# EAGLE design tinyled (EAGLE 8.7.1)
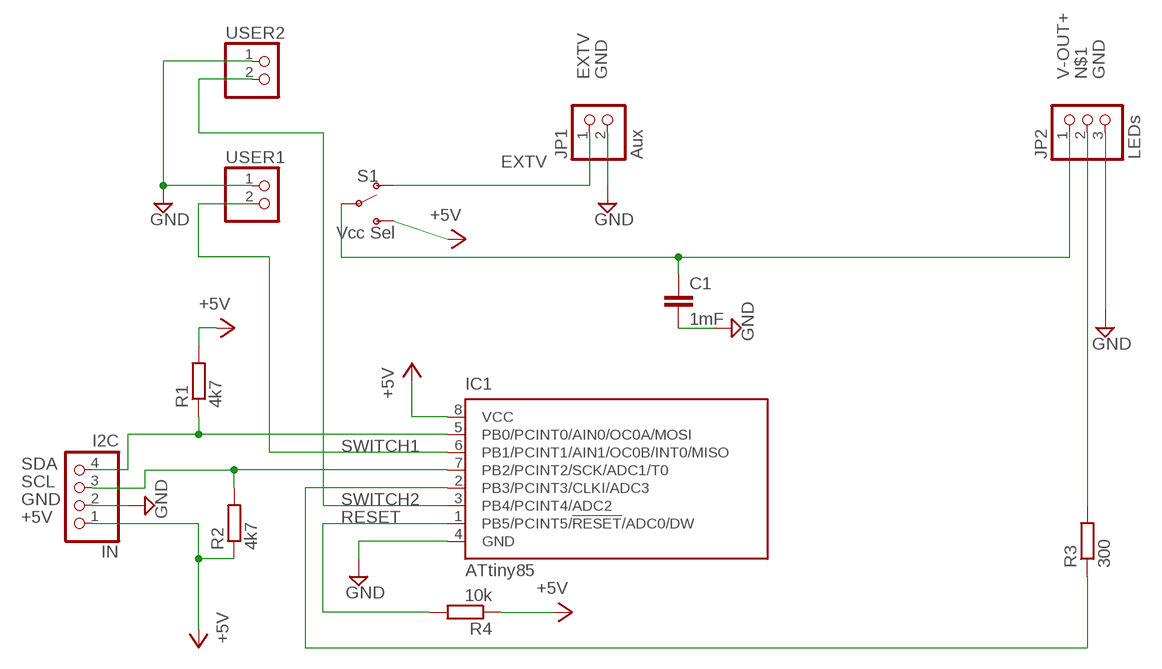
[diagram p0: schematic, sheet 1]

## Parts
C1  1mF  C-EU050-025X075  [C050-025X075]
IC1  ATtiny85  TINY13-20PU  [DIL08]
IN  I2C  PINHD-1X4/90  [1X04/90]
JP1  Aux  PINHD-1X2/90  [1X02/90]
JP2  LEDs  PINHD-1X3/90  [1X03/90]
R1  4k7  R0204/7  [0204/7]
R2  4k7  R0204/7  [0204/7]
R3  300  R0204/7  [0204/7]
R4  10k  R0204/7  [0204/7]
S1  Vcc Sel  SWITCH-SPDT-PTH-11.6X4.0MM  [SWITCH_SPDT_PTH_11.6X4.0MM]
USER1  PINHD-1X2  [1X02]
USER2  PINHD-1X2  [1X02]

## Nets
+5V: IC1.8(VCC) IN.1 R1.2 R2.1 R4.1 S1.3(S)
DATA: IC1.2(PB3/PCINT3/CLKI/ADC3) R3.1
EXTV [highload]: JP1.1 S1.1(O)
GND [highload]: C1.2 IC1.4(GND) IN.2 JP1.2 JP2.3 USER1.1 USER2.1
N$1: JP2.2 R3.2
RESET: IC1.1(PB5/PCINT5/!RESET!/ADC0/DW) R4.2
SCL: IC1.7(PB2/PCINT2/SCK/ADC1/T0) IN.3 R2.2
SDA: IC1.5(PB0/PCINT0/AIN0/OC0A/MOSI) IN.4 R1.1
SWITCH1: IC1.6(PB1/PCINT1/AIN1/OC0B/INT0/MISO) USER1.2
SWITCH2: IC1.3(PB4/PCINT4/ADC2) USER2.2
V-OUT+ [highload]: C1.1 JP2.1 S1.2(P)

## Library data of the parts
C1 = resistor:C-EU: CAPACITOR, European symbol
IC1 = atmel:TINY13: 8-bit AVR Microcontroller with 1K Bytes In-System Programmable Flash Source: http://www.atmel.com/dyn/resources/prod_documents/2535S.pdf; MPN: ATTINY13-20PU; OC_FARNELL: 9171550; OC_NEWARK: 96K6521
IN = pinhead:PINHD-1X4: PIN HEADER
JP1 USER1 USER2 = pinhead:PINHD-1X2: PIN HEADER
JP2 = pinhead:PINHD-1X3: PIN HEADER
R1-R4 = eagle-ltspice:R: RESISTOR, European symbol; SPICEMODEL: NONE; SPICEPREFIX: R
S1 = SparkFun-Switches:SWITCH-SPDT: Single Pole, Double Throw (SPDT) Switch Single-pole, double-throw (SPDT) switch. Variant Overview SMD-AYZ0202 Surface Mount DPDT Switch <https://www.sparkfun.com/products/597> (COM-00597) Used on e.g. LilyPad Arduino USB - ATmega32U4 Board <https://www.sparkfun.com/products/12049> PTH-11.6X4.0MM SPDT Mini Power Switch <https://www.sparkfun.com/products/102> (COM-00102) Used on e.g. SparkFun Simon Says - Through-Hole Soldering Kit <https://www.sparkfun.com/products/10547> (KIT-10547) PTH-11.6X4.0MM-KIT KIT version of SPDT Mini Power Switch - Simplifies soldering by removing tStop of switch pins - only one side can be soldered. PTH-11.6X4.0MM-LOCK LOCK version of SPDT Mini Power Switch - Offset pins hold switch in place for easier soldering. SMD-RIGHT-ANGLE Surface Mount Right Angle Switch <https://www.sparkfun.com/products/10860> (COM-10860) Used on e.g. SparkFun ESP8266 Thing <https://www.sparkfun.com/products/13231>; PROD_ID: SWCH-08261; SF_SKU: COM-00102

## Net classes
1 highload: width 0.813 mm

## Board
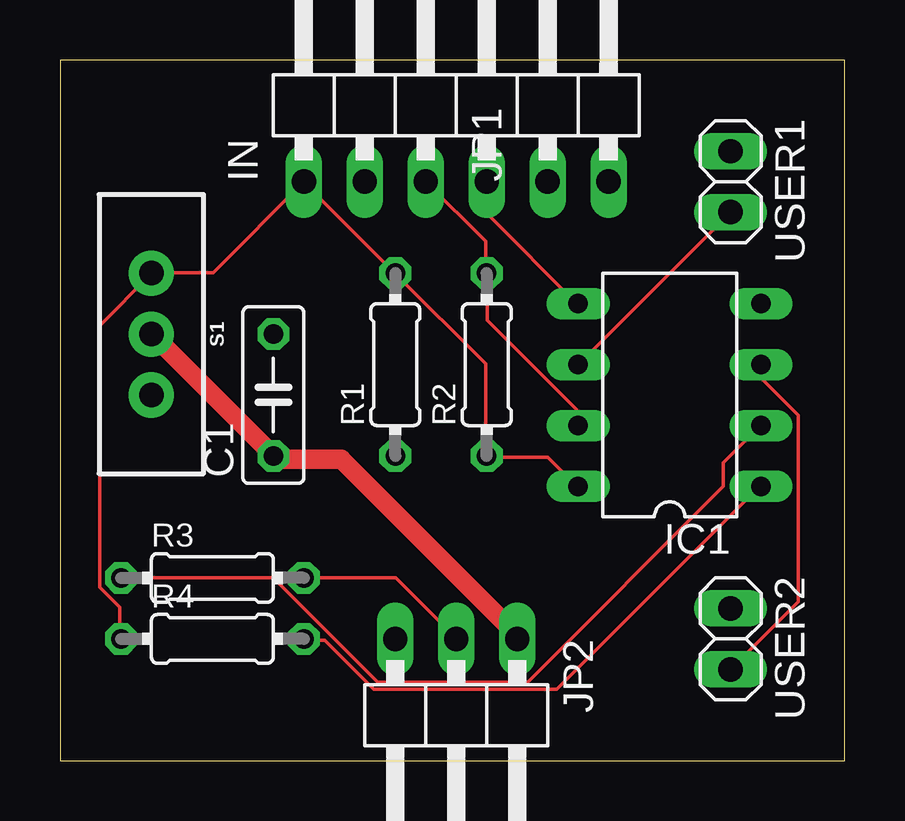
[diagram p1: board, top side]
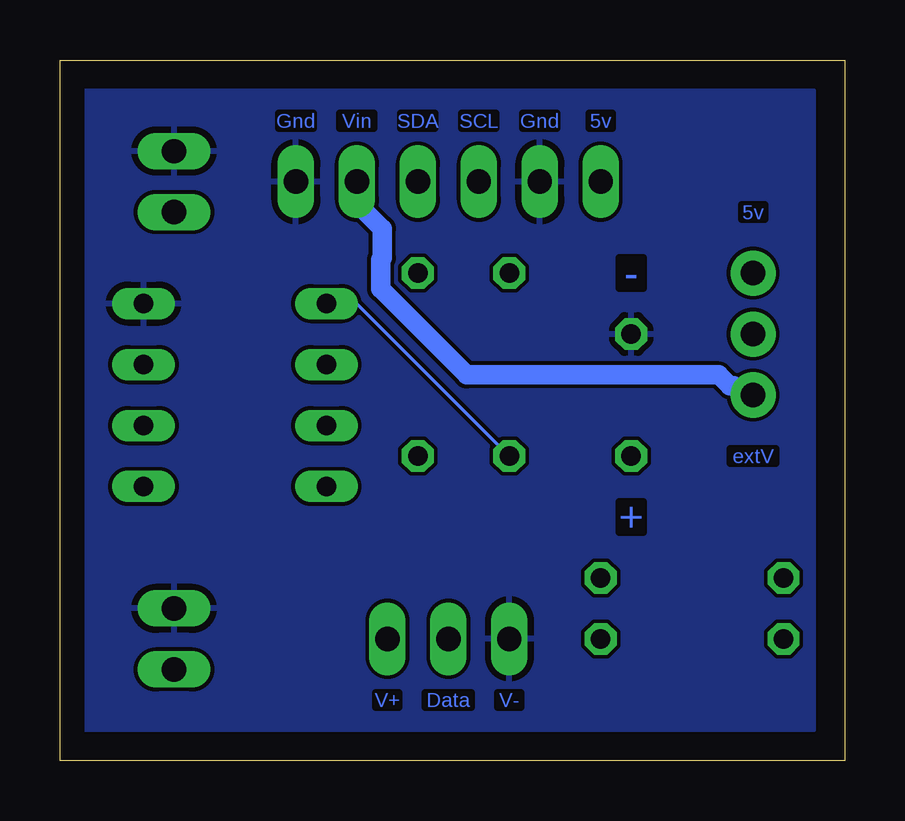
[diagram p2: board, bottom side, seen from below]

Size 32.69 x 29.2 mm. Coordinates in mm from the lower left corner, seen from the top.
Outline: 0,0 32.69,0 32.69,29.2 0,29.2 0,0
Copper layers (1*16): Top 0.035mm / dielectric 1.5mm / Bottom 0.035mm
Design rules "default": minimum track width 6mil, minimum drill 0.35mm, track to track 6mil, track to pad 6mil, pad to pad 6mil, via to via 6mil, smd to smd 6mil, copper to edge 40mil, drill to drill 6mil, minimum pad ring 10mil, minimum via ring 8mil, stop-mask expansion 4mil, vias tented up to drill 0mil, thermal gap 10mil

### Footprints (pad centres in the part's own frame; a part is rotated, then mirrored left to right if it is on the bottom)
C050-025X075 = drill 0.813 octagon: 1 -2.54,0; 2 2.54,0
DIL08 = drill 0.813 long: 1 -3.81,-3.81; 2 -1.27,-3.81; 3 1.27,-3.81; 4 3.81,-3.81; 5 3.81,3.81; 6 1.27,3.81; 7 -1.27,3.81; 8 -3.81,3.81
1X04/90 = drill 1.016 long: 1 -3.81,-3.81; 2 -1.27,-3.81; 3 1.27,-3.81; 4 3.81,-3.81
1X02/90 = drill 1.016 long: 1 -1.27,-3.81; 2 1.27,-3.81
1X03/90 = drill 1.016 long: 1 -2.54,-3.81; 2 0,-3.81; 3 2.54,-3.81
0204/7 = drill 0.813 octagon: 1 -3.81,0; 2 3.81,0
SWITCH_SPDT_PTH_11.6X4.0MM = drill 1.016 pad 1.88: 1 0,2.54; 2 0,0; 3 0,-2.54
1X02 = drill 1.016 long: 1 -1.27,0; 2 1.27,0

### Placement (x,y rotation side)
C1  8.89,15.24 90 top
IC1  25.4,15.24 90 top
IN  13.97,27.94 0 top
JP1  21.59,27.94 0 top
JP2  16.51,1.27 180 top
R1  13.97,16.51 90 top
R2  17.78,16.51 90 top
R3  6.35,7.62 0 top
R4  6.35,5.08 0 top
S1  3.81,17.78 180 top
USER1  27.94,24.13 270 top
USER2  27.94,5.08 270 top

### Tracks (layer width: path | path; a pad name or v marks a point on that pad's centre or on a via)
+5V
  Top 0.152: R4.1 2.49,5.11 2.49,6.4 1.65,7.24 1.65,18.14 3.79,20.27 S1.3 3.86,20.34 6.38,20.34 IN.1 10.18,24.08 13.92,20.34 R1.2 13.99,20.27 17.73,16.54 17.73,12.72 R2.1 17.8,12.65 20.32,12.65 21.54,11.43 IC1.8
DATA
  Top 0.152: R3.1 8.89,7.62 13.23,3.28 19.48,3.28 27.63,11.43 27.63,12.42 29.16,13.95 IC1.2
EXTV
  Bottom 0.813: JP1.1 20.32,23.24 19.25,22.17 19.25,20.95 19.33,20.88 19.33,19.66 15.75,16.08 5.23,16.08 4.78,15.62 4.62,15.62 4.24,15.24 S1.1
GND
  pour Bottom: 1.27,27.94 31.75,27.94 31.75,1.27 1.27,1.27
N$1
  Top 0.152: R3.2 13.99,7.62 16.51,5.11 JP2.2
RESET
  Top 0.152: R4.2 10.18,5.03 11.02,5.03 13.08,2.97 20.7,2.97 29.16,11.43 IC1.1
SCL
  Top 0.152: IN.3 17.73,21.64 17.73,20.34 R2.2 17.8,20.27 17.8,18.36 21.54,14.63 21.54,14.02 IC1.7
SDA
  Top 0.152: IN.4 17.8,24.08 17.8,22.78 21.54,19.05 IC1.5
  Bottom 0.152: R1.1 20.32,19.05 IC1.5
SWITCH1
  Top 0.152: USER1.2 IC1.6
SWITCH2
  Top 0.152: USER2.2 30.76,6.63 30.76,14.4 29.23,15.93 29.23,16.46 IC1.3
V-OUT+
  Top 0.813: S1.2 3.86,17.75 8.89,12.72 C1.1 9.27,12.57 11.71,12.57 19.02,5.26 19.02,5.11 JP2.1

### Text on the board
Bottom: 5v | Gnd | SCL | SDA | Vin | Gnd | 5v | - | extV | + | V- | Data | V+